# EAGLE schematic oresat-batteries-inhibits-blockdiagram (EAGLE 9.6.2)
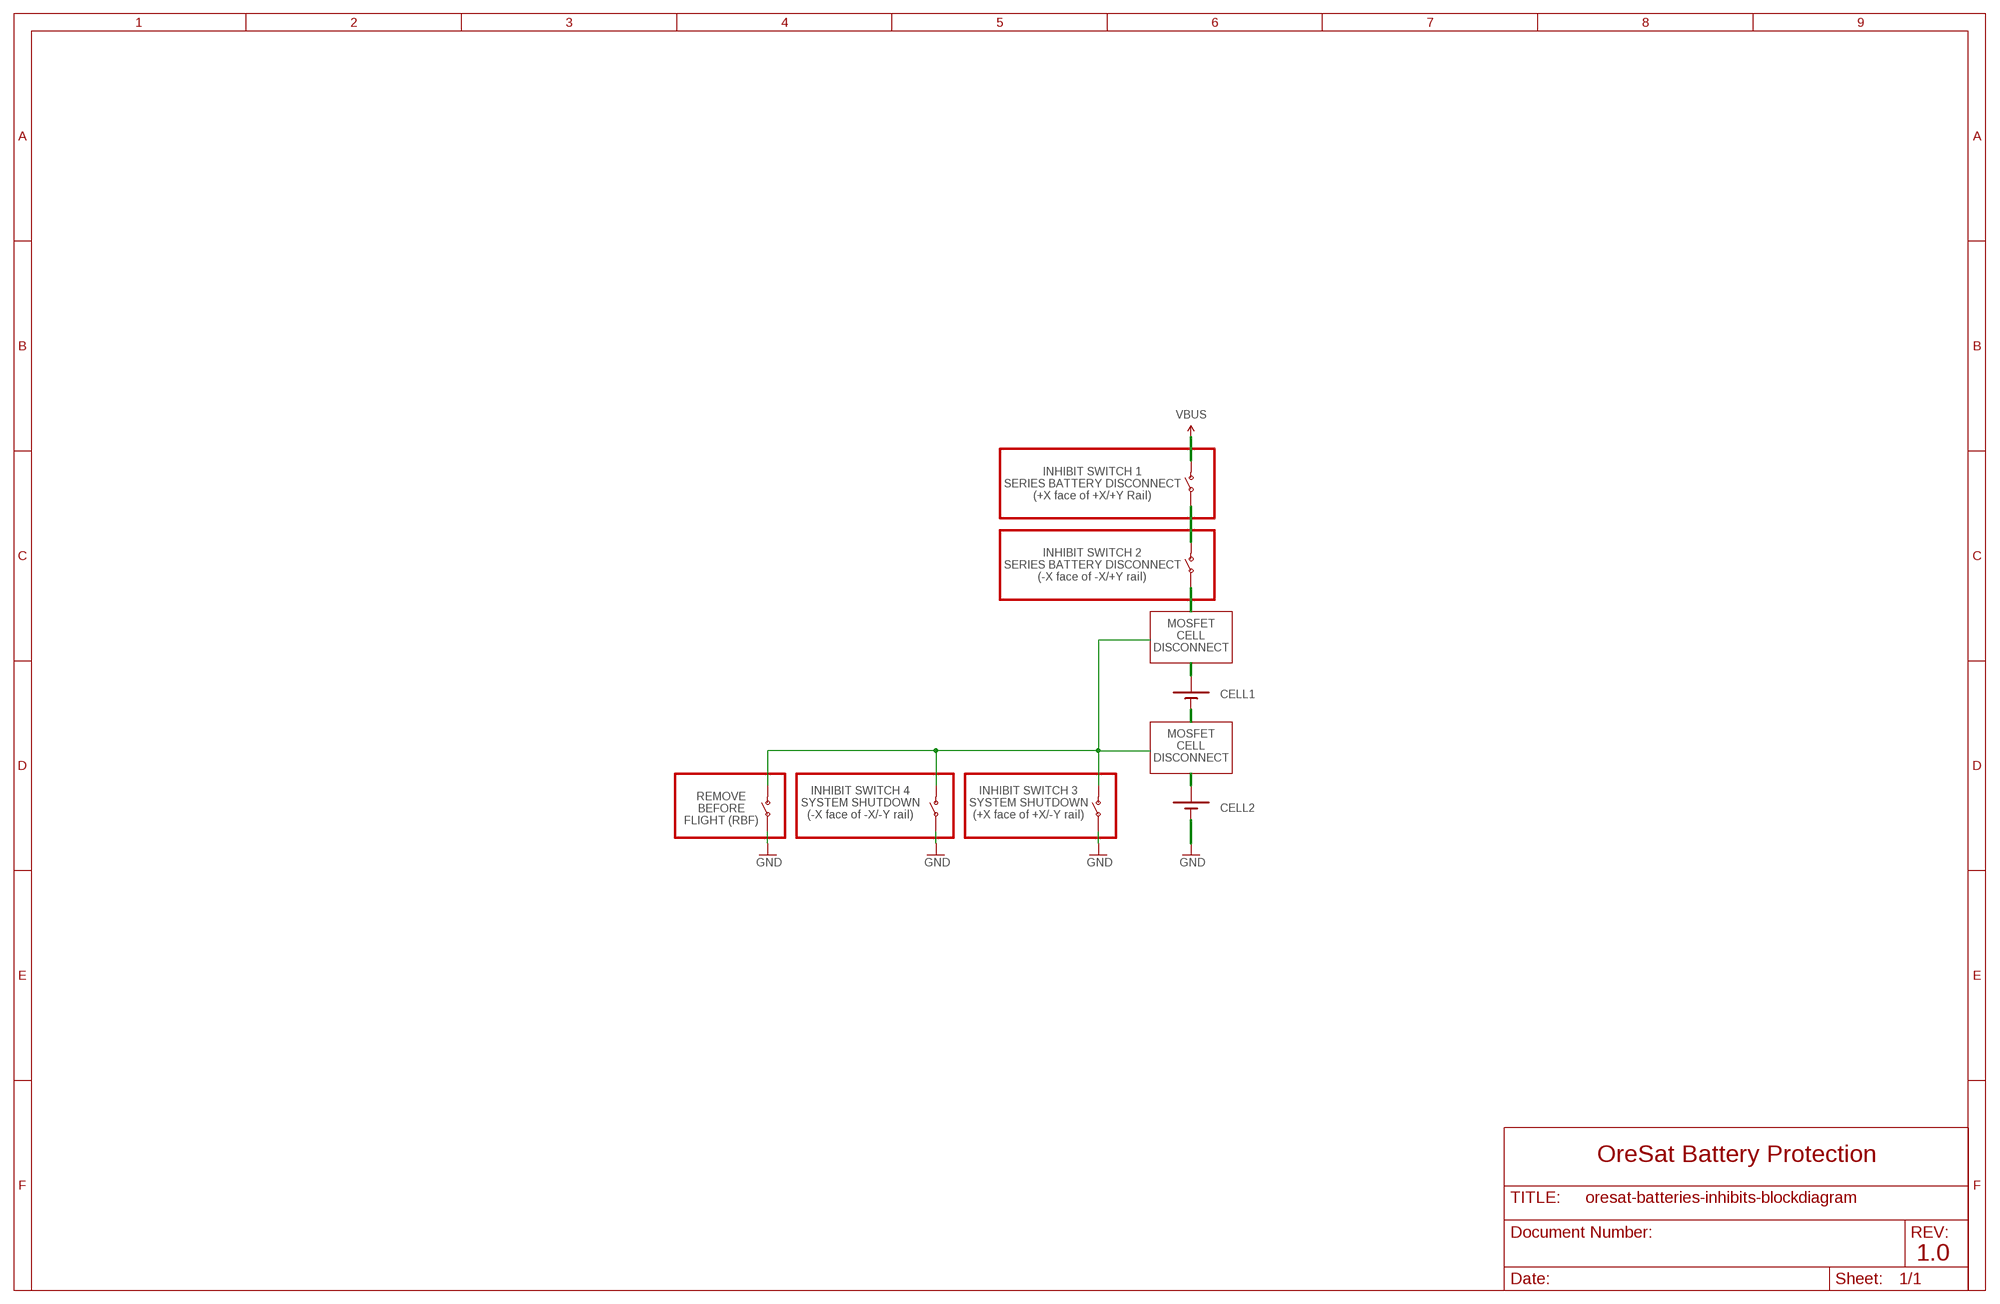
[diagram p0: schematic, sheet 1]

## Parts
CELL1  B-18650-LI-BATTERY  [18650]
CELL2  B-18650-LI-BATTERY  [18650]
U$1  SWITCH-SPST-2TV  [SWITCH-SPST-VERTICAL]
U$2  SWITCH-SPST-2TV  [SWITCH-SPST-VERTICAL]
U$3  SWITCH-SPST-2TV  [SWITCH-SPST-VERTICAL]
U$4  SWITCH-SPST-2TV  [SWITCH-SPST-VERTICAL]
U$5  SWITCH-SPST-2TV  [SWITCH-SPST-VERTICAL]

## Nets
GND: CELL2.NEG-T(NEG) U$2.2(P) U$3.2(P) U$5.2(P)
N$5 [BATTERY]: U$1.2(P)
N$7 [BATTERY]: CELL1.NEG-T(NEG)
N$13: U$2.1(O) U$3.1(O) U$5.1(O)
VBATT-F-PK1 [BATTERY]: U$1.1(O) U$4.2(P)
VBATT-NEG-PK1 [BATTERY]: CELL2.POS-T(POS)
VBATT-NEG-PK2 [BATTERY]: CELL1.POS-T(POS)
VBUS [BATTERY]: U$4.1(O)

## Notes on the sheet
- INHIBIT SWITCH 1
  SERIES BATTERY DISCONNECT
  (+X face of +X/+Y Rail)
- INHIBIT SWITCH 2
  SERIES BATTERY DISCONNECT
  (-X face of -X/+Y rail)
- MOSFET
  CELL
  DISCONNECT
- MOSFET
  CELL
  DISCONNECT
- INHIBIT SWITCH 4
  SYSTEM SHUTDOWN
  (-X face of -X/-Y rail)
- INHIBIT SWITCH 3
  SYSTEM SHUTDOWN
  (+X face of +X/-Y rail)
- REMOVE
  BEFORE
  FLIGHT (RBF)
- OreSat Battery Protection
- 1.0

## Library data of the parts
CELL1 CELL2 = B-18650-Li-battery:B-18650-LI-BATTERY; DIS: Tenergy; DPN: MH48285; MFR: Tenergy; MPN: MH48285
U$1-U$5 = SparkFun-v5:SWITCH-SPST-2

## Net classes
1 SHUTDOWN: clearance 0.25 mm
2 BATTERY: clearance 0.25 mm